# Altium schematic sheet Mosaic-Bus.SchDoc
size A4; SheetNumber: 1; SheetTotal: 3
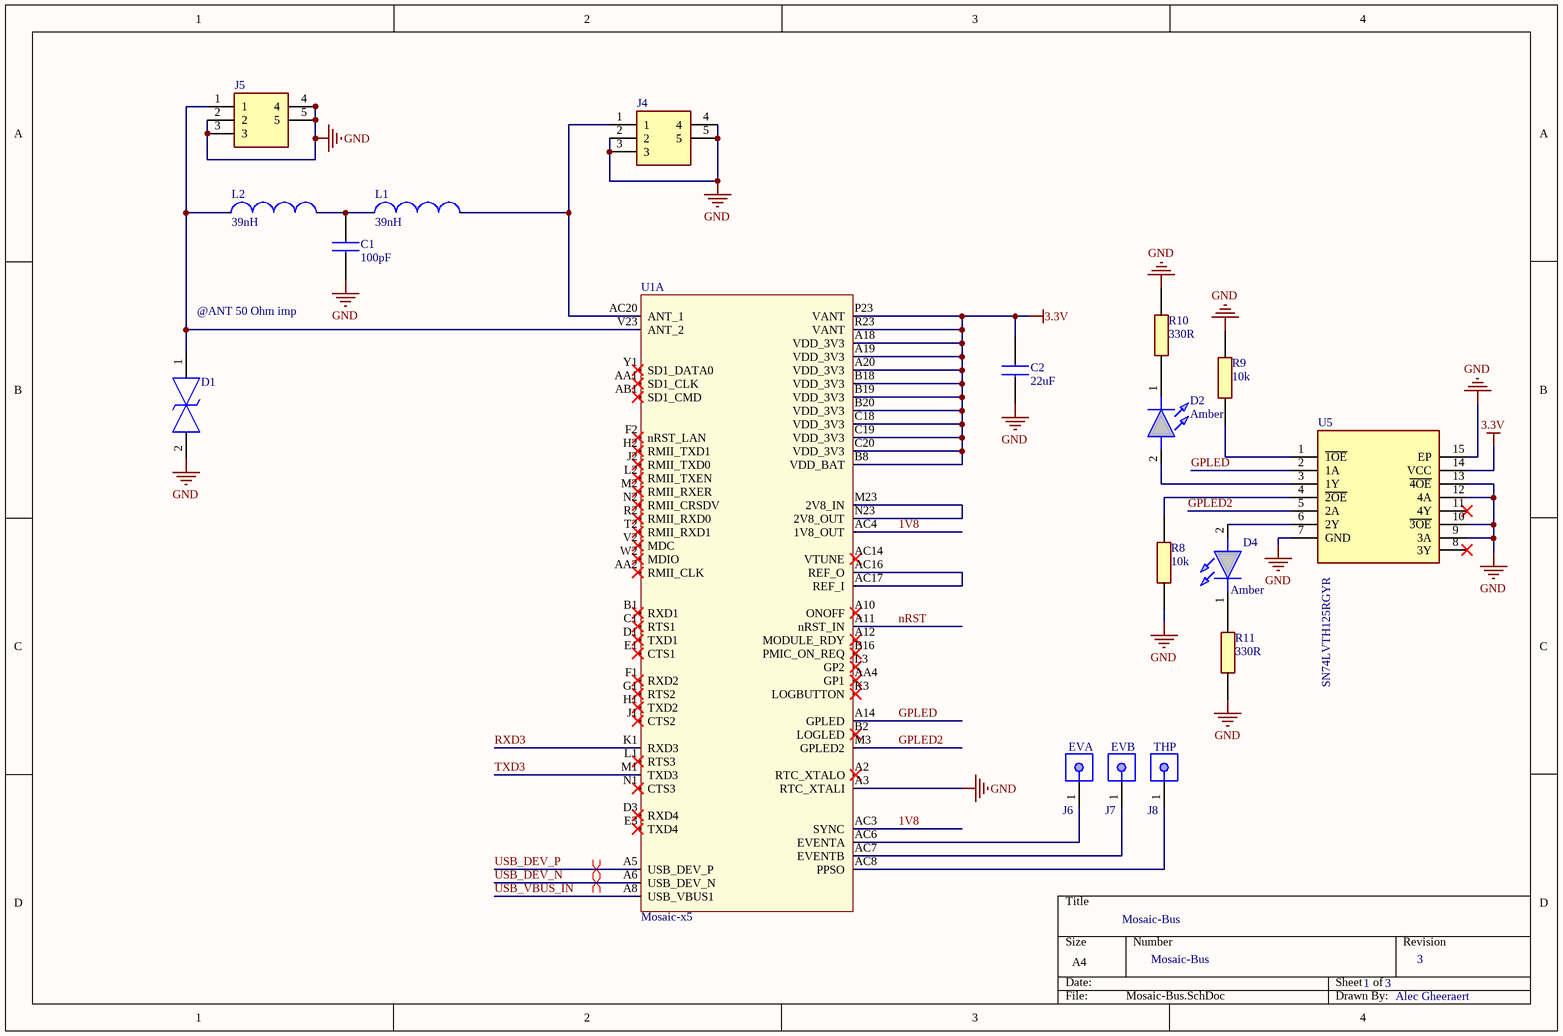
[diagram p0: Mosaic-Bus.SchDoc]

## Parts
C1  100pF  [CAPC0603X35N]
C2  22uF  [CAPC2012X145N]
D1  TPD1E0B04DPYR  [TPD1E0B04DPYR]  (value not drawn)
D2  Amber  [155060AS75300]
D4  Amber  [155060AS75300]
J4  73415-1472  [MMCX-734151472]  (value not drawn)
J5  73415-1472  [MMCX-734151472]  (value not drawn)
J6  EVA  [TECO-5-146280-2_V]
J7  EVB  [TECO-5-146280-2_V]
J8  THP  [TECO-5-146280-2_V]
L1  39nH  [744786139A]
L2  39nH  [744786139A]
R8  10k  [RESC1608X60N]
R9  10k  [RESC1608X60N]
R10  330R  [RESC1608X60N]
R11  330R  [RESC1608X60N]
U1  Mosaic-x5  [Mosaic-x5]  (part A of 3)
U5  SN74LVTH125RGYR  [QFN50P350X350X100-15N-D]

## Nets
3.3V: C2.1 U1.A18(VDD_3V3) U1.A19(VDD_3V3) U1.A20(VDD_3V3) U1.B8(VDD_BAT) U1.B18(VDD_3V3) U1.B19(VDD_3V3) U1.B20(VDD_3V3) U1.C18(VDD_3V3) U1.C19(VDD_3V3) U1.C20(VDD_3V3) U1.P23(VANT) U1.R23(VANT) U5.14(VCC)
GND: C1.1 C2.2 D1.2 J4.2 J4.3 J4.4 J4.5 J5.2 J5.3 J5.4 J5.5 R8.2 R9.2 R10.2 R11.1 U1.A3(RTC_XTALI) U5.7(GND) U5.9(3A) U5.10(~{3OE}) U5.12(4A) U5.13(~{4OE}) U5.15(EP)
1V8: U1.AC3(SYNC) U1.AC4(1V8_OUT)
GPLED: U1.A14(GPLED) U5.2(1A)
GPLED2: U1.M3(GPLED2) U5.5(2A)
nRST: U1.A11(nRST_IN)
RXD3: U1.K1(RXD3)
TXD3: U1.M1(TXD3)
USB_DEV_N: U1.A6(USB_DEV_N)
USB_DEV_P: U1.A5(USB_DEV_P)
USB_VBUS_IN: U1.A8(USB_VBUS1)
NetC1_2: C1.2 L1.2 L2.1
NetD1_1: D1.1 J5.1 L2.2 U1.V23(ANT_2)
NetD2_1: D2.1(K) R10.1
NetD2_2: D2.2(A) U5.3(1Y)
NetD4_1: D4.1(K) R11.2
NetD4_2: D4.2(A) U5.6(2Y)
NetJ4_1: J4.1 L1.1 U1.AC20(ANT_1)
NetJ6_1: J6.1 U1.AC6(EVENTA)
NetJ7_1: J7.1 U1.AC7(EVENTB)
NetJ8_1: J8.1 U1.AC8(PPSO)
NetR8_1: R8.1 U5.4(~{2OE})
NetR9_1: R9.1 U5.1(~{1OE})
NetU1_AC16: U1.AC16(REF_O) U1.AC17(REF_I)
NetU1_M23: U1.M23(2V8_IN) U1.N23(2V8_OUT)

Not connected (* = marked no-connect by the designer): U1 A2(RTC_XTALO)* A10(ONOFF)* A12(MODULE_RDY)* AA1(SD1_CLK)* AA2(RMII_CLK)* AA4(GP1)* AB1(SD1_CMD)* AC14(VTUNE)* B1(RXD1)* B2(LOGLED)* B16(PMIC_ON_REQ)* C1(RTS1)* D1(TXD1)* D3(RXD4)* E1(CTS1)* E3(TXD4)* F1(RXD2)* F2(nRST_LAN)* G1(RTS2)* H1(TXD2)* H2(RMII_TXD1)* J1(CTS2)* J2(RMII_TXD0)* K3(LOGBUTTON)* L1(RTS3)* L2(RMII_TXEN)* L3(GP2)* M2(RMII_RXER)* N1(CTS3)* N2(RMII_CRSDV)* R2(RMII_RXD0)* T2(RMII_RXD1)* V2(MDC)* W2(MDIO)* Y1(SD1_DATA0)*; U5 8(3Y)* 11(4Y)*

## Layout directives
differential pair: USB_DEV_N, USB_DEV_P

## Notes on the sheet
- @ANT 50 Ohm imp
- Mosaic-Bus
- 1
- 3
- Alec Gheeraert

## Library data of the parts
C1 = CMP-013-000003-3: 100pF Capacitor; Manufacturer: Walsin; VoltageRating: 25V; Dielectric: C0G; Tolerance: 5%; Capacitance: 100pF; Size: 0603
C2 = CMP-013-000005-3: 22uF Capacitor; Manufacturer: Walsin; Dielectric: X5R; Capacitance: 22µF; Tolerance: 10%; VoltageRating: 6.3V; Size: 2012
D1 = CMP-019-000007-3: TVS Diode Bidirectional 1-Channel; Manufacturer: Texas Instruments; Type: TVS Diode
D2 D4 = CMP-00011-4: Amber LED; Manufacturer: Wurth Elektronik; ForwardCurrent: 2A; ForwardVoltage: 20mV; Size: 1608; Color: Amber
J4 J5 = CMP-007-000002-4: MMCX Connector; Manufacturer: Molex
J6-J8 = CMP-00010-1: Through hole pin
L1 L2 = CMP-00001-4: 39nH Inductor; Manufacturer: Wurth Elektronik; Frequency: 1.4GHz; Tolerance: 5%; Shielding: Shielded; Inductance: 39nH; Size: 1608
R8 R9 = CMP-052-000001-5: 10kOhm Resistor; Manufacturer: Walsin; VoltageRating: 50V; Tolerance: 5%; PowerRating: 100mW; Size: 1608; Resistance: 10k
R10 R11 = CMP-00017-2: 330Ohm Resistor; Manufacturer: Walsin; Resistance: 330; Tolerance: 5%; PowerRating: 100mW; VoltageRating: 50V; Size: 1608
U1 = CP-Mosaic-x5-7: Septentrio Mosaic x5
U5 = CMP-00009-5: 3-State Output Driver; Manufacturer: Texas Instruments; Supply Voltage: 3.3V; Inputs: 4; Output Current: 64mA; Outputs: 3; Case: VQFN-14